# Altium schematic sheet 5V0Regulator.SchDoc
size A4; SheetNumber: 4; SheetTotal: 5
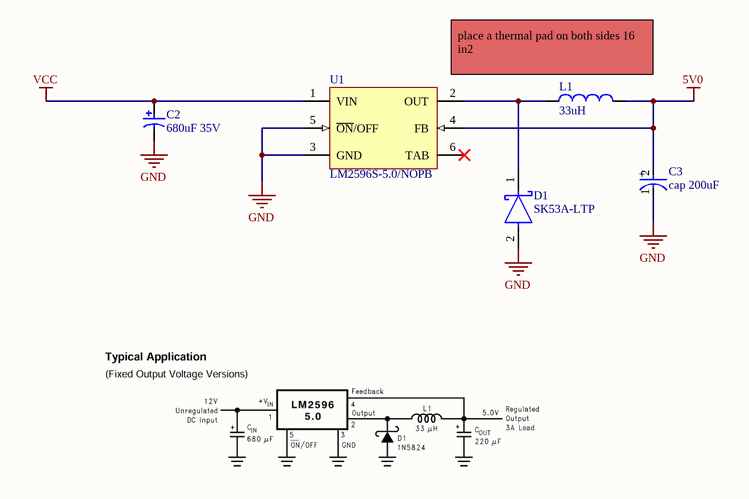
[diagram p0: 5V0Regulator.SchDoc]

## Parts
C2  680uF 35V  [NIC-CAPA2-10X10_V]
C3  cap 200uF  [CAPAE7262X77M]
D1  SK53A-LTP  [FP-DO-214AC-MFG]
L1  33uH  [INDM140130X52N]
U1  LM2596S-5.0/NOPB  [KTT0005B_M]

## Nets
5V0: C3.2(A) L1.2 U1.4(FB)
GND: C2.2 C3.1(C) D1.2(A) U1.3(GND) U1.5(~{ON}/OFF)
VCC: C2.1 U1.1(VIN)
NetD1_1: D1.1(C) L1.1 U1.2(OUT)

Not connected (* = marked no-connect by the designer): U1 6(TAB)*

## Notes on the sheet
- place a thermal pad on both sides 16 in2
- (in symbol cap 200uF) +

## Library data of the parts
C2 = CMP-0687-00001-1: Aluminum Electrolytic Capacitor, UD Series, Low Impedance, 680 uF, 10 V, + / - 20%, -55 to 105 degC, Chip Type, 10 x 10 mm D x L, Pb-Free, Reel; PartNumber: UUD1A681MNL1GS; Manufacturer: Nichicon; Tolerance Rated Capacitance: -20 to 20%; Rated Voltage: 10 V; Impedance: 0.09 Ohm; Rated Ripple Current (at 100kHz): 670 mA; Packing: Dia382mm Reel; Endurance Time: 5000 h; RoHS: TRUE; PackageDescription: 2-Pin Surface Mount Device, Diameter 10 mm, Height 10 mm, Pitch 8 mm; DatasheetVersion: 08/2012; PackageReference: CAPAE-D10H10; ComponentLink1URL: http://www.nichicon.co.jp/; Rated Capacitance: 680 uF; Mounting Technology: Surface Mount; ComponentLink1Description: Manufacturer URL; Length: 10 mm; ComponentLink3Description: Package Specification; ComponentLink2URL: http://products.nichicon.co.jp/en/pdf/XJA043/e-ud.pdf; ComponentLink2Description: Datasheet; Diameter: 10 mm; ComponentLink3URL: http://products.nichicon.co.jp/en/pdf/XJA043/e-ud.pdf
D1 = CMP-56206-000004-1: DIODE SCHOTTKY 5A 30V SMA; Mount: Surface Mount; Max Reverse Voltage (DC): 30V; Case/Package: SMA; Packaging: Tape and Reel; Average Rectified Current: 5A
L1 = ind 330uH: Supplier 1: LCSC; Supplier Part Number 1: C19268660
U1 = CMP-0069-00269-3: SIMPLE SWITCHER® Power Converter 150 KHz 3A Step-Down Voltage Regulator, 5-pin TO-263, Pb-Free; Manufacturer: Texas Instruments; PowerWise: N; PackageTopMarking: NSUZXYTTE#*LM2596S*-5.0 P+; ComponentLink1URL: http://www.ti.com/general/docs/lit/getliterature.tsp?genericPartNumber=LM2596&fileType=pdf; PackageDescription: TO-263, Molded, .400 x .390 x .180in, 5 Lead, .067in Pitch, Surface Mount; RoHS: Y; PinCount: 5; Code_JEDEC: MO-169-AB; ComponentLink1Description: Datasheet URL; PackageReference: KTT0005B; CompType: Switcher
C3 = cap 200uF: Supplier 1: LCSC; Supplier Part Number 1: C4747975